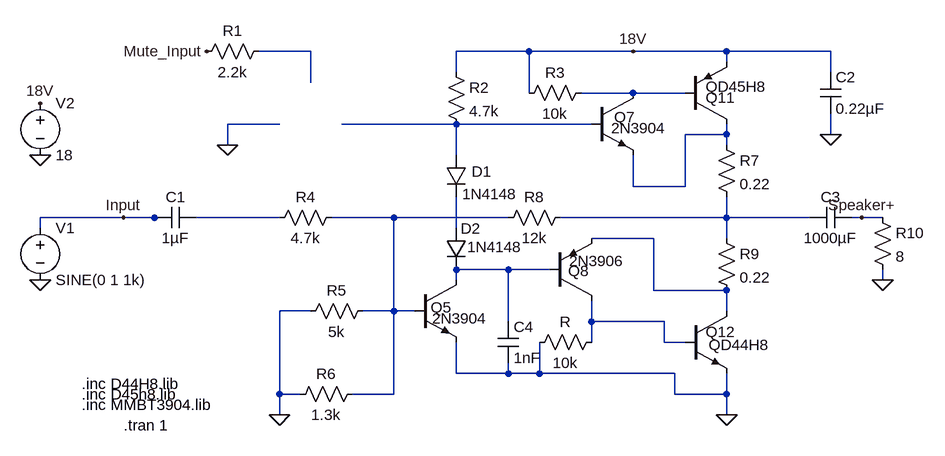
[diagram p0: schematic Dorr_half_circuit.asc]
Dorr_half_circuit.asc, the LTspice schematic file:
Version 4
SHEET 1 1772 2552
WIRE -32 -64 -112 -64
WIRE 304 -64 192 -64
WIRE 464 -64 304 -64
WIRE 608 -64 464 -64
WIRE 768 -64 608 -64
WIRE 608 -48 608 -64
WIRE 192 -32 192 -64
WIRE 768 -32 768 -64
WIRE -32 -16 -32 -64
WIRE 304 0 304 -64
WIRE 464 0 384 0
WIRE 544 0 464 0
WIRE -80 48 -160 48
WIRE 192 48 16 48
WIRE 400 48 192 48
WIRE 608 64 608 48
WIRE 608 64 544 64
WIRE 768 64 768 32
WIRE -160 80 -160 48
WIRE 608 80 608 64
WIRE 192 96 192 48
WIRE 464 144 464 96
WIRE 544 144 544 64
WIRE 544 144 464 144
WIRE -320 192 -448 192
WIRE -272 192 -320 192
WIRE -256 192 -272 192
WIRE -80 192 -208 192
WIRE 96 192 0 192
WIRE 272 192 96 192
WIRE 608 192 608 160
WIRE 608 192 352 192
WIRE 736 192 608 192
WIRE 816 192 800 192
WIRE 848 192 816 192
WIRE -448 208 -448 192
WIRE 192 208 192 160
WIRE 496 224 400 224
WIRE 608 224 608 192
WIRE 272 272 192 272
WIRE 336 272 272 272
WIRE 192 288 192 272
WIRE 848 288 848 272
WIRE 496 304 496 224
WIRE 608 304 496 304
WIRE -32 336 -80 336
WIRE 96 336 96 192
WIRE 96 336 48 336
WIRE 128 336 96 336
WIRE 608 336 608 304
WIRE 272 352 272 272
WIRE 400 352 400 320
WIRE 512 352 400 352
WIRE 400 384 400 352
WIRE 512 384 512 352
WIRE 544 384 512 384
WIRE 192 432 192 384
WIRE 272 432 272 416
WIRE 272 432 192 432
WIRE 320 432 320 384
WIRE 320 432 272 432
WIRE 528 432 320 432
WIRE -80 464 -80 336
WIRE -48 464 -80 464
WIRE 96 464 96 336
WIRE 96 464 32 464
WIRE 528 464 528 432
WIRE 608 464 608 432
WIRE 608 464 528 464
WIRE -80 496 -80 464
WIRE 608 496 608 464
FLAG -160 80 0
FLAG -80 496 0
FLAG 768 64 0
FLAG 608 496 0
FLAG 816 192 Speaker+
FLAG -320 192 Input
FLAG -192 -64 Mute_Input
FLAG -448 288 0
FLAG -448 96 0
FLAG -448 16 18V
FLAG 464 -64 18V
FLAG 848 288 0
DATAFLAG 96 48 ""
DATAFLAG 96 192 ""
DATAFLAG 608 192 ""
DATAFLAG -288 192 ""
DATAFLAG 608 64 ""
DATAFLAG 96 48 ""
SYMBOL res -96 -80 R90
WINDOW 0 0 56 VBottom 2
WINDOW 3 32 56 VTop 2
SYMATTR InstName R1
SYMATTR Value 2.2k
SYMBOL res 176 -48 R0
SYMATTR InstName R2
SYMATTR Value 4.7k
SYMBOL res 400 -16 R90
WINDOW 0 0 56 VBottom 2
WINDOW 3 32 56 VTop 2
SYMATTR InstName R3
SYMATTR Value 10k
SYMBOL res -96 208 R270
WINDOW 0 32 56 VTop 2
WINDOW 3 0 56 VBottom 2
SYMATTR InstName R4
SYMATTR Value 4.7k
SYMBOL cap -272 208 R270
WINDOW 0 32 32 VTop 2
WINDOW 3 0 32 VBottom 2
SYMATTR InstName C1
SYMATTR Value 1µF
SYMBOL res 64 320 R90
WINDOW 0 0 56 VBottom 2
WINDOW 3 32 56 VTop 2
SYMATTR InstName R5
SYMATTR Value 5k
SYMBOL res 48 448 R90
WINDOW 0 0 56 VBottom 2
WINDOW 3 32 56 VTop 2
SYMATTR InstName R6
SYMATTR Value 1.3k
SYMBOL npn2 128 288 R0
WINDOW 0 25 42 Left 2
WINDOW 3 27 59 Left 2
SYMATTR InstName Q5
SYMATTR Value 2N3904
SYMBOL diode 176 96 R0
WINDOW 0 40 25 Left 2
WINDOW 3 25 60 Left 2
SYMATTR InstName D1
SYMATTR Value 1N4148
SYMBOL npn2 400 0 R0
WINDOW 0 35 37 Left 2
WINDOW 3 30 54 Left 2
SYMATTR InstName Q7
SYMATTR Value 2N3904
SYMBOL pnp2 544 48 M180
WINDOW 0 32 41 Left 2
WINDOW 3 32 58 Left 2
SYMATTR InstName Q11
SYMATTR Value QD45H8
SYMBOL cap 752 -32 R0
SYMATTR InstName C2
SYMATTR Value 0.22µF
SYMBOL res 592 64 R0
SYMATTR InstName R7
SYMATTR Value 0.22
SYMBOL res 256 208 R270
WINDOW 0 32 56 VTop 2
WINDOW 3 0 56 VBottom 2
SYMATTR InstName R8
SYMATTR Value 12k
SYMBOL diode 176 208 R0
WINDOW 0 23 1 Left 2
WINDOW 3 33 29 Left 2
SYMATTR InstName D2
SYMATTR Value 1N4148
SYMBOL res 592 208 R0
SYMATTR InstName R9
SYMATTR Value 0.22
SYMBOL cap 736 208 R270
WINDOW 0 32 32 VTop 2
WINDOW 3 0 32 VBottom 2
SYMATTR InstName C3
SYMATTR Value 1000µF
SYMBOL npn2 544 336 R0
WINDOW 0 32 32 Left 2
WINDOW 3 36 52 Left 2
SYMATTR InstName Q12
SYMATTR Value QD44H8
SYMBOL cap 256 352 R0
SYMATTR InstName C4
SYMATTR Value 1nF
SYMBOL pnp2 336 320 M180
WINDOW 0 28 46 Left 2
WINDOW 3 30 61 Left 2
SYMATTR InstName Q8
SYMATTR Value 2N3906
SYMBOL res 416 368 R90
WINDOW 0 0 56 VBottom 2
WINDOW 3 32 56 VTop 2
SYMATTR InstName R
SYMATTR Value 10k
SYMBOL voltage -448 192 R0
WINDOW 123 0 0 Left 0
WINDOW 39 0 0 Left 0
SYMATTR InstName V1
SYMATTR Value SINE(0 1 1k)
SYMBOL voltage -448 0 R0
WINDOW 123 0 0 Left 0
WINDOW 39 0 0 Left 0
SYMATTR InstName V2
SYMATTR Value 18
SYMBOL res 832 176 R0
SYMATTR InstName R10
SYMATTR Value 8
TEXT -320 512 Left 2 !.tran 1
TEXT -384 480 Left 2 !.inc MMBT3904.lib
TEXT -384 464 Left 2 !.inc D45h8.lib
TEXT -384 448 Left 2 !.inc D44H8.lib

The netlist it stands for:
* Dorr_half_circuit.asc
R1 N001 Mute_Input 2.2k
R2 18V N003 4.7k
R3 N002 18V 10k
R4 N005 N006 4.7k
C1 Input N005 1µF
R5 N006 0 5k
R6 N006 0 1.3k
Q5 N010 N006 0 0 2N3904
D1 N003 N008 1N4148
Q7 N002 N003 N004 0 2N3904
Q11 N004 N002 18V 0 QD45H8
C2 18V 0 0.22µF
R7 N004 N007 0.22
R8 N006 N007 12k
D2 N008 N010 1N4148
R9 N007 N009 0.22
C3 N007 Speaker+ 1000µF
Q12 N009 N011 0 0 QD44H8
C4 N010 0 1nF
Q8 N011 N010 N009 0 2N3906
R N011 0 10k
V1 Input 0 SINE(0 1 1k)
V2 18V 0 18
R10 Speaker+ 0 8
.model D D
.lib standard.dio
.model NPN NPN
.model PNP PNP
.lib standard.bjt
.tran 1
.inc MMBT3904.lib
.inc D45h8.lib
.inc D44H8.lib
.backanno
.end